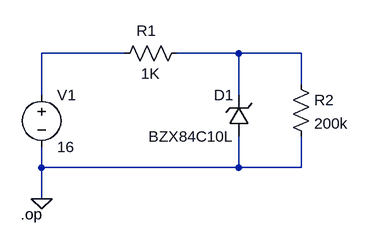
[diagram p0: schematic Zener dioide.asc]
Zener dioide.asc, the LTspice schematic file:
Version 4.1
SHEET 1 880 680
WIRE -48 80 -176 80
WIRE 128 80 32 80
WIRE 224 80 128 80
WIRE 224 128 224 80
WIRE -176 144 -176 80
WIRE 128 144 128 80
WIRE -176 256 -176 224
WIRE 128 256 128 208
WIRE 128 256 -176 256
WIRE 224 256 224 208
WIRE 224 256 128 256
WIRE -176 304 -176 256
FLAG -176 304 0
DATAFLAG 128 80 ""
DATAFLAG -176 80 ""
SYMBOL res 48 64 R90
WINDOW 0 -3 62 VBottom 2
WINDOW 3 32 56 VTop 2
SYMATTR InstName R1
SYMATTR Value 1K
SYMBOL voltage -176 128 R0
WINDOW 123 0 0 Left 0
WINDOW 39 0 0 Left 0
SYMATTR InstName V1
SYMATTR Value 16
SYMBOL res 208 112 R0
SYMATTR InstName R2
SYMATTR Value 200k
SYMBOL zener 144 208 R180
WINDOW 0 24 64 Left 2
WINDOW 3 24 0 Left 2
SYMATTR InstName D1
SYMATTR Value BZX84C10L
TEXT -208 328 Left 2 !.op

The netlist it stands for:
* Zener dioide.asc
R1 N002 N001 1K
V1 N001 0 16
R2 N002 0 200k
D1 0 N002 BZX84C10L
.model D D
.lib standard.dio
.op
.backanno
.end